# EAGLE design Pcm5102 (EAGLE 6.4)
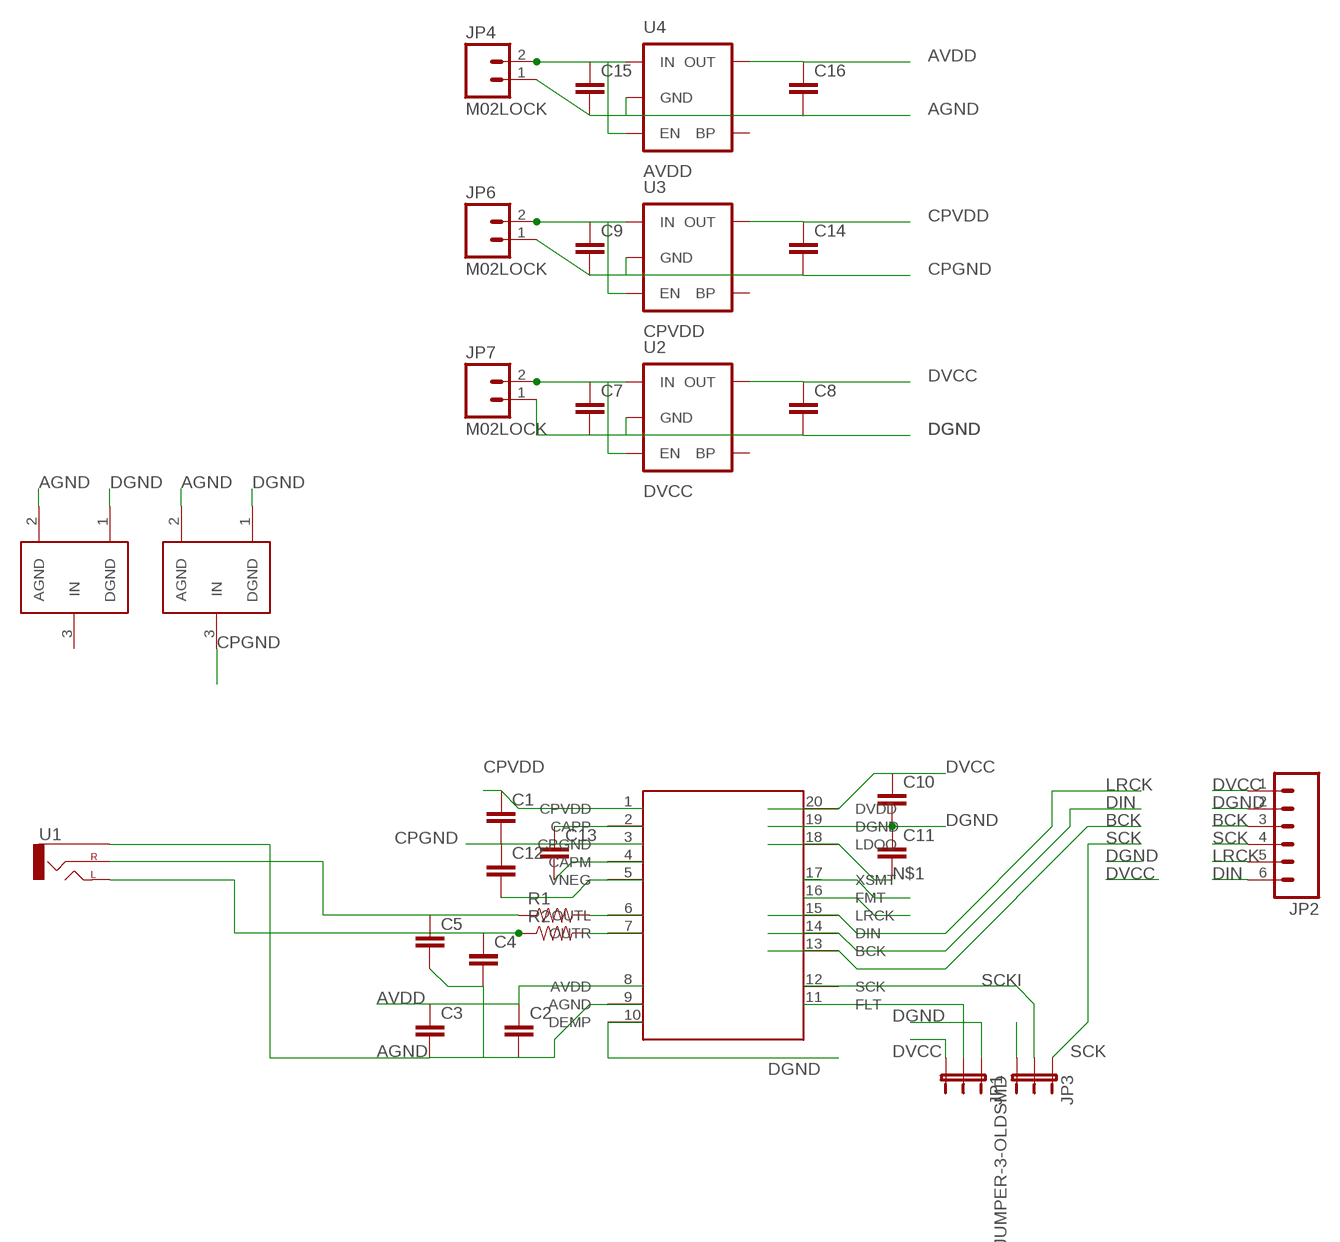
[diagram p0: schematic, sheet 1]

## Parts
C1  CAP0805  [0805]
C2  CAP0805  [0805]
C3  CAP0805  [0805]
C4  CAPPTH1  [CAP-PTH-5MM]
C5  CAPPTH1  [CAP-PTH-5MM]
C7  CAP0805  [0805]
C8  CAP0805  [0805]
C9  CAP0805  [0805]
C10  CAP0805  [0805]
C11  CAP0805  [0805]
C12  CAP0805  [0805]
C13  CAP0805  [0805]
C14  CAP0805  [0805]
C15  CAP0805  [0805]
C16  CAP0805  [0805]
JP1  JUMPER-3-OLDPTH  [1X03]
JP2  M06LOCK  [1X06_LOCK]
JP3  JUMPER-3-OLDSMD  [SJ_3]
JP4  M02LOCK  [1X02_LOCK]
JP6  M02LOCK  [1X02_LOCK]
JP7  M02LOCK  [1X02_LOCK]
R1  RESISTORPTH-1/4W  [AXIAL-0.4]
R2  RESISTORPTH-1/4W  [AXIAL-0.4]
U1  AUDIO-JACKPTH  [AUDIO-JACK]
U2  DVCC  V_REG_LDOSMD  [SOT23-5]
U3  CPVDD  V_REG_LDOSMD  [SOT23-5]
U4  AVDD  V_REG_LDOSMD  [SOT23-5]
U$1  PCM5102  [TSSOP20]
U$2  GND_CONNECT  [GND_CONNECT]
U$3  GND_CONNECT  [GND_CONNECT]

## Nets
AGND: C2.2 C3.2 C4.2 C5.2 C15.2 C16.2 JP4.1 U1.SLEEVE U4.2(GND) U$1.9(AGND) U$2.2(AGND) U$3.2(AGND)
AVDD: C2.1 C3.1 C16.1 U4.5(OUT) U$1.8(AVDD)
BCK: JP2.3 U$1.13(BCK)
CPGND: C1.2 C9.2 C12.1 C14.2 JP6.1 U3.2(GND) U$1.3(CPGND) U$2.3(IN)
CPVDD: C1.1 C14.1 U3.5(OUT) U$1.1(CPVDD)
DGND: C7.2 C8.2 C10.2 C11.1 JP1.1 JP2.2 JP3.3 JP7.1 U2.2(GND) U$1.10(DEMP) U$1.16(FMT) U$1.19(DGND) U$2.1(DGND) U$3.1(DGND)
DIN: JP2.6 U$1.14(DIN)
DVCC: C8.1 C10.1 JP1.3 JP2.1 U2.5(OUT) U$1.17(XSMT) U$1.20(DVDD)
LRCK: JP2.5 U$1.15(LRCK)
N$1: C11.2 U$1.18(LDOO)
N$2: R1.P$2 U$1.6(OUTL)
N$3: JP1.2 U$1.11(FLT)
N$5: C13.1 U$1.2(CAPP)
N$6: C13.2 U$1.4(CAPM)
N$7: C12.2 U$1.5(VNEG)
N$8: R2.P$2 U$1.7(OUTR)
N$10: C15.1 JP4.2 U4.1(IN) U4.3(EN)
N$11: C5.1 R1.P$1 U1.RING(RIGHT)
N$12: C4.1 R2.P$1 U1.TIP(LEFT)
N$15: C9.1 JP6.2 U3.1(IN) U3.3(EN)
N$16: C7.1 JP7.2 U2.1(IN) U2.3(EN)
SCK: JP2.4 JP3.1
SCKI: JP3.2 U$1.12(SCK)
Unconnected: U2.4(BP) U3.4(BP) U4.4(BP) U$3.3(IN)

## Library data of the parts
C1-C5 C7-C16 = SparkFun-Capacitors:CAP: Capacitor Standard 0603 ceramic capacitor, and 0.1" leaded capacitor.
JP1 JP3 = SparkFun-Passives:JUMPER-3-OLD
JP2 = SparkFun-Connectors:M06: Header 6 Standard 6-pin 0.1" header. Use with straight break away headers (SKU : PRT-00116), right angle break away headers (PRT-00553), swiss pins (PRT-00743), machine pins (PRT-00117), and female headers (PRT-00115). Molex polarized connector foot print use with SKU : PRT-08094 with associated crimp pins and housings. NOTES ON THE VARIANTS LOCK and LOCK_LONGPADS... This footprint was designed to help hold the alignment of a through-hole component (i.e. 6-pin header) while soldering it into place. You may notice that each hole has been shifted either up or down by 0.005 of an inch from it's more standard position (which is a perfectly straight line). This slight alteration caused the pins (the squares in the middle) to touch the edges of the holes. Because they are alternating, it causes a "brace" to hold the component in place. 0.005 has proven to be the perfect amount of "off-center" position when using our standard breakaway headers. Although looks a little odd when you look at the bare footprint, once you have a header in there, the alteration is very hard to notice. Also,if you push a header all the way into place, it is covered up entirely on the bottom side. This idea of altering the position of holes to aid alignment will be further integrated into the Sparkfun Library for other footprints. It can help hold any component with 3 or more connection pins.
JP4 JP6 JP7 = SparkFun-Connectors:M02: Standard 2-pin 0.1" header. Use with - straight break away headers ( PRT-00116) - right angle break away headers (PRT-00553) - swiss pins (PRT-00743) - machine pins (PRT-00117) - female headers (PRT-00115) Molex polarized connector foot print use with: PRT-08233 with associated crimp pins and housings. 2.54_SCREWTERM for use with PRT-10571. 3.5mm Screw Terminal footprints for PRT-08084 5mm Screw Terminal footprints for use with PRT-08433
R1 R2 = SparkFun-Resistors:RESISTOR: Resistor Basic schematic elements and footprints for 0603, 1206, and PTH resistors.
U1 = SparkFun-Connectors:AUDIO-JACK: 3.5mm Audio Jack Simple 3.5mm common PCB mount audio jack. SKU: PRT-08032
U2-U4 = SparkFun-PowerIC:V_REG_LDO: Voltage Regulator LDO Standard 150mA LDO voltage regulator in SOT-23 layout. Micrel part MIC5205. BP (by-pass) pin is used to lower output noise with 470pF cap.
U$1 = adafruit:PCM5102
U$2 U$3 = SparkFun-Passives:GND_CONNECT: Use to make a connection of multiple grounds in only one place.

## Net classes
0 default: width 0.254 mm

## Board
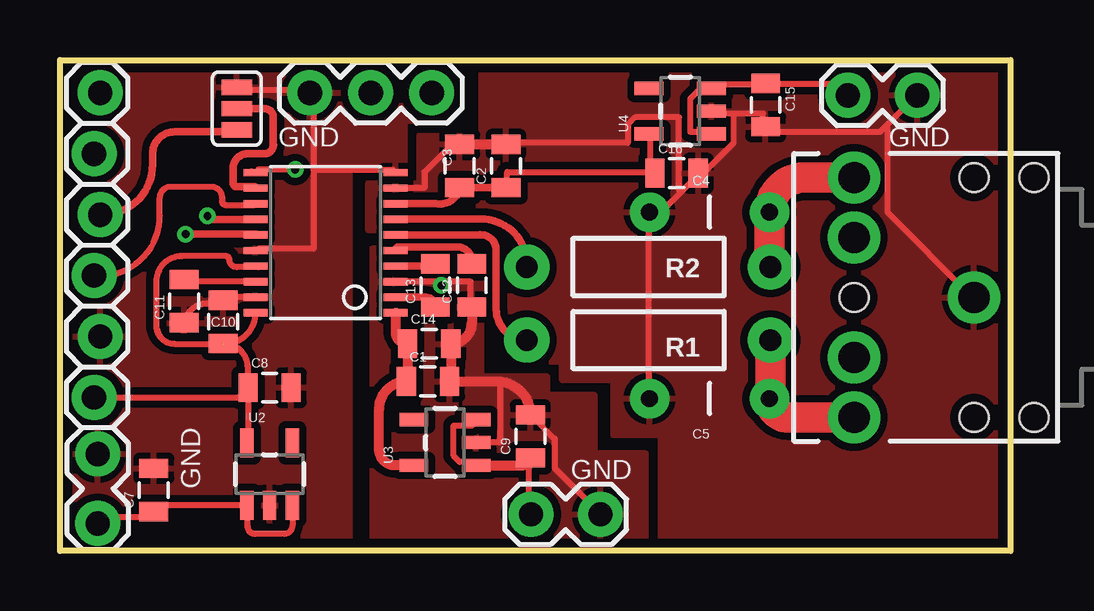
[diagram p1: board, top side]
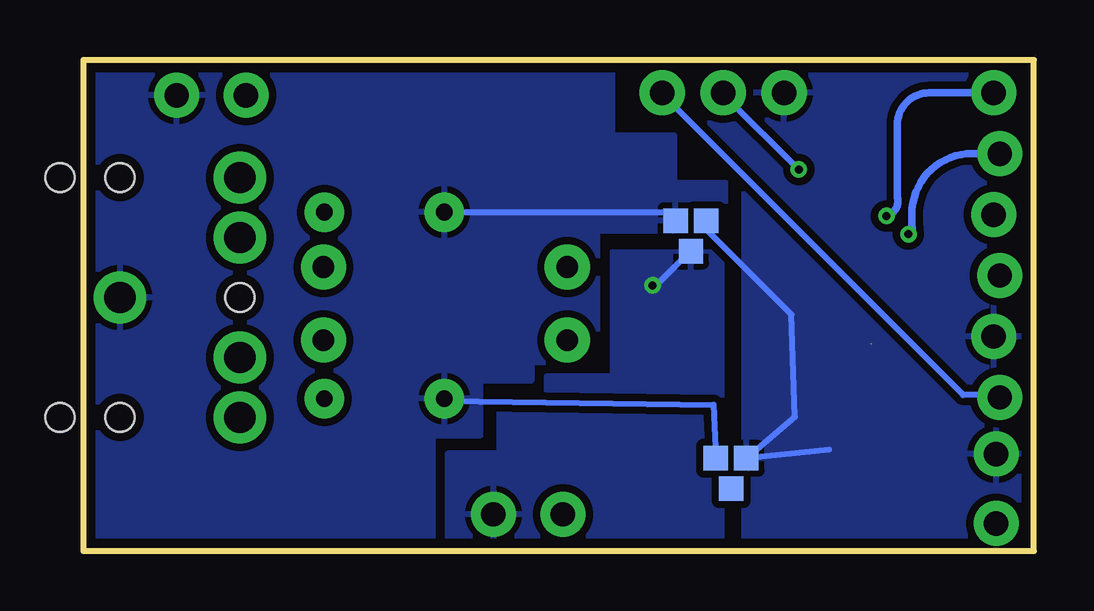
[diagram p2: board, bottom side, seen from below]

Size 39.62 x 20.47 mm. Coordinates in mm from the lower left corner, seen from the top.
Outline: 0,20.47 39.62,20.47 39.62,0 0,0 0,20.47
Copper layers (1*16): Top 0.0356mm / dielectric 1.5011mm / Bottom 0.0356mm
Design rules "LaenPCBOrder *": minimum track width 6mil, minimum drill 13mil, track to track 6mil, track to pad 6mil, pad to pad 6mil, via to via 6mil, smd to smd 6mil, copper to edge 15mil, drill to drill 6mil, minimum pad ring 7mil, minimum via ring 7mil, stop-mask expansion 3mil, vias tented up to drill 3mil, thermal gap 10mil

### Footprints (pad centres in the part's own frame; a part is rotated, then mirrored left to right if it is on the bottom)
0805 = smd 0.8 x 1.2: 1 -0.9,0; 2 0.9,0
CAP-PTH-5MM = drill 0.7 pad 1.651: 1 -2.5,0; 2 2.5,0
1X03 = drill 1.016 pad 1.88: 1 0,0; 2 2.54,0; 3 5.08,0
1X06_LOCK = drill 1.016 pad 1.88: 1 0,0; 2 2.54,-0.254; 3 5.08,0; 4 7.62,-0.254; 5 10.16,0; 6 12.7,-0.254
SJ_3 = smd 0.635 x 1.27: 1 -0.889,0; 2 0,0; 3 0.889,0
1X02_LOCK = drill 1.016 pad 1.88: 1 -0.178,0; 2 2.718,0
AXIAL-0.4 = drill 0.9 pad 1.88: P$1 -5.08,0; P$2 5.08,0
AUDIO-JACK = drill 1.3 pad 2.184: RING 5,5; RSH 5,2.5; SLEEVE 0,0; TIP 5,-5; TSH 5,-2.5 | hole 1.2: 0,5; -2.5,5; -2.5,-5; 0,-5; 5,0
SOT23-5 = smd 0.55 x 1.2: 1 -0.95,-1.3; 2 0,-1.3; 3 0.95,-1.3; 4 0.95,1.3; 5 -0.95,1.3
TSSOP20 = smd 0.305 x 0.991: 1 -2.925,-2.918; 2 -2.275,-2.918; 3 -1.625,-2.918; 4 -0.975,-2.918; 5 -0.325,-2.918; 6 0.325,-2.918; 7 0.975,-2.918; 8 1.625,-2.918; 9 2.275,-2.918; 10 2.925,-2.918; 11 2.925,2.918; 12 2.275,2.918; 13 1.625,2.918; 14 0.975,2.918; 15 0.325,2.918; 16 -0.325,2.918; 17 -0.975,2.918; 18 -1.625,2.918; 19 -2.275,2.918; 20 -2.925,2.918
GND_CONNECT = smd 1.016 x 1.016: 1 -1.016,0; 2 -1.016,-1.27; 3 0.254,-0.635

### Placement (x,y rotation side)
C1  15.34,7.06 0 top
C2  18.59,16.05 90 top
C3  16.66,16.05 90 top
C4  27.08,14.12 180 top
C5  27.08,6.35 180 top
C7  3.91,2.54 90 top
C8  8.74,6.81 0 top
C9  19.61,4.78 90 top
C10  6.81,9.55 90 top
C11  5.18,10.41 90 top
C12  17.17,11.07 90 top
C13  15.65,11.07 90 top
C14  15.39,8.64 0 top
C15  29.41,18.59 270 top
C16  25.7,15.75 0 top
JP1  10.41,19.1 0 top
JP2  1.42,6.4 90 top
JP3  7.37,18.44 90 top
JP4  35.56,19 180 top
JP6  22.35,1.52 180 top
JP7  1.57,3.86 270 top
R1  24.54,8.79 180 top
R2  24.54,11.84 180 top
U1  38.1,10.57 180 top
U2  8.74,3.2 0 top
U3  16.05,4.52 90 top
U4  25.86,18.34 90 top
U$1  11.07,12.85 90 top
U$2  13.67,12.75 270 bottom
U$3  11.99,2.84 270 bottom

### Tracks (layer width: path | path; a pad name or v marks a point on that pad's centre or on a via)
AGND
  Top 0.254: U$1.9 14.12,15.14 15.19,15.14 15.19,15.8 16.36,16.97 C3.2 | 24.54,14.12 24.54,6.5 C5.2 | 28.09,18.24 29.31,18.24 29.31,17.78 C15.2 29.46,17.63 29.46,17.48 34.19,17.48 34.42,17.7 | 28.09,18.24 27.18,18.24 U4.2 | 25.88,14.96 25.2,14.27 C4.2 | 25.88,14.96 26.57,15.65 C16.2 26.72,15.65 28.09,17.02 28.09,18.24 | C2.2 18.64,17.02 23.67,17.02 23.67,17.78 23.98,18.08 25.81,18.08 25.81,15.04 25.88,14.96 | 34.42,17.7 35.71,19 JP4.1 | U1.SLEEVE 38,10.62 34.49,14.12 34.49,17.63 34.42,17.7
  Top 0.406: 24.54,14.12 C4.2 25.2,14.12 | C3.2 C2.2
  Bottom 0.254: U$3.2 13.36,6.1 24.54,6.25 C5.2 | U$2.2 15.29,14.12 C4.2
  pour Top (isolate 0.305): 17.58,17.32 17.58,21.44 41.05,21.44 41.05,-0.97 25.04,-0.97 25.04,4.83 23.06,4.83 23.06,7.11 20.93,7.11 20.93,7.87 18.19,7.87 18.19,13.36 12.85,13.36 12.85,15.34 14.99,15.34 14.99,17.32
  pour Bottom (isolate 0.305): 17.58,21.44 43.33,21.44 43.33,-0.97 25.04,-0.97 25.04,4.83 23.06,4.83 23.06,7.11 20.93,7.11 20.93,7.87 18.19,7.87 18.19,13.36 12.85,13.36 12.85,15.34 14.99,15.34 14.99,17.32 17.58,17.32
AVDD
  Top 0.254: U4.5 24.59,17.32 24.59,15.95 24.74,15.8 C16.1 24.59,15.8 18.64,15.8 18.64,15.19 C2.1
  Top 0.305: U$1.8 15.68,14.48 arc90 C3.1 C2.1
BCK
  Top 0.254: JP2.3 1.68,11.48 arc90 4.17,13.97 4.17,14.73 arc-90 4.62,15.19 6.3,15.19 arc-90 6.76,14.73 6.76,14.58 arc90 6.91,14.43 8.11,14.43 arc90 U$1.13
CPGND  (via drill 0.33)
  Top 0.254: 15.9,11.23 17.12,11.23 17.12,10.31 C12.1 | 15.9,11.23 14.07,11.23 U$1.3 | 15.9,11.23 v15.9,11.07 | U3.2 18.34,4.52 18.34,6.96 18.22,7.06 | JP6.1 22.45,1.63 20.62,3.45 20.62,4.67 19.71,5.59 C9.2
  Top 0.406: C12.1 17.17,9.51 arc-90 C14.2 16.29,7.11 arc-90 C1.2 18.22,7.06 arc-90 C9.2 arc90 19.54,5.74 19.41,5.74
  Bottom 0.254: v15.9,11.07 15.75,11.07 14.38,12.45 U$2.3
  pour Top (isolate 0.305): 24.43,-1.57 24.43,4.06 22.3,4.06 22.3,6.5 20.32,6.5 20.32,7.26 17.58,7.26 17.58,12.6 13,12.6 13,-1.57
  pour Bottom (isolate 0.305): 13,12.45 17.58,12.45 17.58,7.26 20.32,7.26 20.32,6.5 22.3,6.5 22.3,4.06 24.43,4.06 24.43,-2.49 13,-2.49
CPVDD
  Top 0.406: U$1.1 13.99,9.14 arc90 C14.1 14.49,7.11 arc-90 C1.1 arc90 13.31,5.93 13.31,4.22 arc90 13.95,3.57 U3.5
DGND
  Top 0.254: 10.57,15.9 13.87,15.9 U$1.10 | 10.57,15.9 10.57,18.95 JP1.1 10.31,18.95 10.31,19.2 7.52,19.2 JP3.3 | 10.57,15.9 10.57,12.6 8.28,12.6 U$1.16 | U$1.19 6.93,10.58 arc90 C10.2 6.27,10.3 arc90 C11.1
  Top 0.305: 0.97,8.94 JP2.2
  Bottom 0.254: 8.53,4.22 U$3.1 9.96,5.59 10.11,9.86 13.61,13.36 13.61,13.67 U$2.1 | 1.68,4.22 JP7.1
  pour Top (isolate 0.305): 12.09,-1.12 12.09,15.95 14.38,15.95 14.38,17.93 16.81,17.93 16.81,21.44 -0.41,21.44 -0.41,-1.12
  pour Bottom (isolate 0.305): 16.81,21.44 16.81,17.93 14.38,17.93 14.38,15.95 12.09,15.95 12.09,-1.12 -3.61,-1.12 -3.61,21.44
DIN  (via drill 0.33)
  Top 0.305: v6.15,13.97 arc90 6.3,13.82 U$1.14 arc90 U$1.14
  Bottom 0.305: JP2.6 4.37,19.1 arc-90 5.69,17.78 5.69,14.73 arc90 v6.15,13.97
DVCC  (1 unrouted)
  Top 0.254: U$1.20 arc-90 6.88,8.65 C10.1 arc-90 7.84,7.62 C8.1 | JP2.1 7.43,6.4 arc90 C8.1 | C8.1 7.84,4.55 arc-90 U2.5 | U$1.17 8.24,11.88 arc-90 8.28,11.84 7.37,11.84 arc-90 7.06,12.14 arc90 6.91,12.29 5.08,12.29 arc90 4.01,11.23 4.01,9.4 arc90 4.78,8.64 6.79,8.64
  Bottom 0.254: JP1.3 15.44,19 2.95,6.5 1.42,6.5 JP2.1
LRCK  (via drill 0.33)
  Top 0.305: v5.23,13.21 8.19,13.21 arc90 U$1.15
  Bottom 0.305: JP2.5 2.34,16.56 arc-90 5.08,14.27 5.08,13.51 arc90 v5.23,13.21
N$1
  Top 0.254: U$1.18 5.27,11.23 arc-90 C11.2
N$2
  Top 0.305: U$1.6 17.46,13.18 arc-90 18.19,12.6 18.19,10.06 arc90 R1.P$2
N$3  (via drill 0.33)
  Top 0.254: v9.8,15.9 8.28,15.9 U$1.11
  Top 0.305: U$1.11 8,15.78 arc-90 7.98,15.8
  Bottom 0.254: v9.8,15.9 12.85,18.95 JP1.2
N$5
  Top 0.305: C13.1 arc90 15.24,10.58 U$1.2
N$6
  Top 0.305: C13.2 arc-90 15.55,11.88 U$1.4
N$7
  Top 0.305: C12.2 arc90 16.62,12.68 14.14,12.68 arc90 U$1.5
N$8
  Top 0.305: R2.P$2 arc90 17.72,13.83 U$1.7
N$10
  Top 0.254: U4.1 27.03,17.48 26.26,17.48 26.26,18.85 26.57,19.15 27.03,19.15 U4.3 27.18,19.3 27.18,19.46 29.31,19.46 C15.1 29.46,19.46 32.82,19.46 32.82,19 JP4.2
N$11
  Top 1.27: R1.P$1 29.62,6.39 arc-90 C5.1 arc90 30.36,5.57 U1.RING
N$12
  Top 1.27: U1.TIP 31.02,15.57 arc90 C4.1 29.58,11.88 arc90 R2.P$1
N$15
  Top 0.254: U3.3 17.17,5.23 16.41,5.23 16.41,3.96 16.66,3.71 17.17,3.71 U3.1 | 19.46,3.61 19.56,3.45 19.56,1.63 JP6.2
  Top 0.406: U3.1 19.3,3.57 arc31 19.46,3.61 arc59 C9.1
N$16
  Top 0.254: JP7.2 1.68,1.17 1.68,1.42 3.71,1.42 C7.1 arc-90 4.17,1.9 U2.1 arc-90 7.82,1.86 7.82,1.02 arc90 8.13,0.71 9.35,0.71 arc90 9.69,1.05 U2.3
SCK
  Top 0.305: JP2.4 1.78,14.02 arc90 3.86,16.1 3.86,16.56 arc-90 4.78,17.48 7.44,17.48 arc90 JP3.1
SCKI
  Top 0.305: JP3.2 8.53,18.44 arc-90 8.89,18.08 8.89,17.02 arc-90 8.59,16.56 7.82,16.56 arc90 7.21,15.95 7.21,15.34 arc90 7.37,15.19 8.09,15.19 arc-90 U$1.12

### Text on the board
tNames: GND | GND | GND | GND
tValues: DIN | LRCK | SCK | FLT | BCK | GND